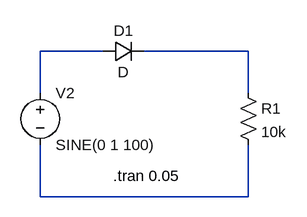
[diagram p0: schematic half wave.asc]
half wave.asc, the LTspice schematic file:
Version 4
SHEET 1 880 680
WIRE 144 80 48 80
WIRE 368 80 208 80
WIRE 48 144 48 80
WIRE 368 144 368 80
WIRE 48 304 48 224
WIRE 368 304 368 224
WIRE 368 304 48 304
SYMBOL voltage 48 128 R0
WINDOW 123 0 0 Left 2
WINDOW 39 0 0 Left 2
SYMATTR InstName V2
SYMATTR Value SINE(0 1 100)
SYMBOL diode 144 96 R270
WINDOW 0 32 32 VTop 2
WINDOW 3 0 32 VBottom 2
SYMATTR InstName D1
SYMBOL res 352 128 R0
SYMATTR InstName R1
SYMATTR Value 10k
TEXT 160 272 Left 2 !.tran 0.05

The netlist it stands for:
* half wave.asc
V2 N001 N003 SINE(0 1 100)
D1 N001 N002 D
R1 N002 N003 10k
.model D D
.lib standard.dio
.tran 0.05
.backanno
.end